# EAGLE design BUS_SPLIT_1 (EAGLE 6.5.0)
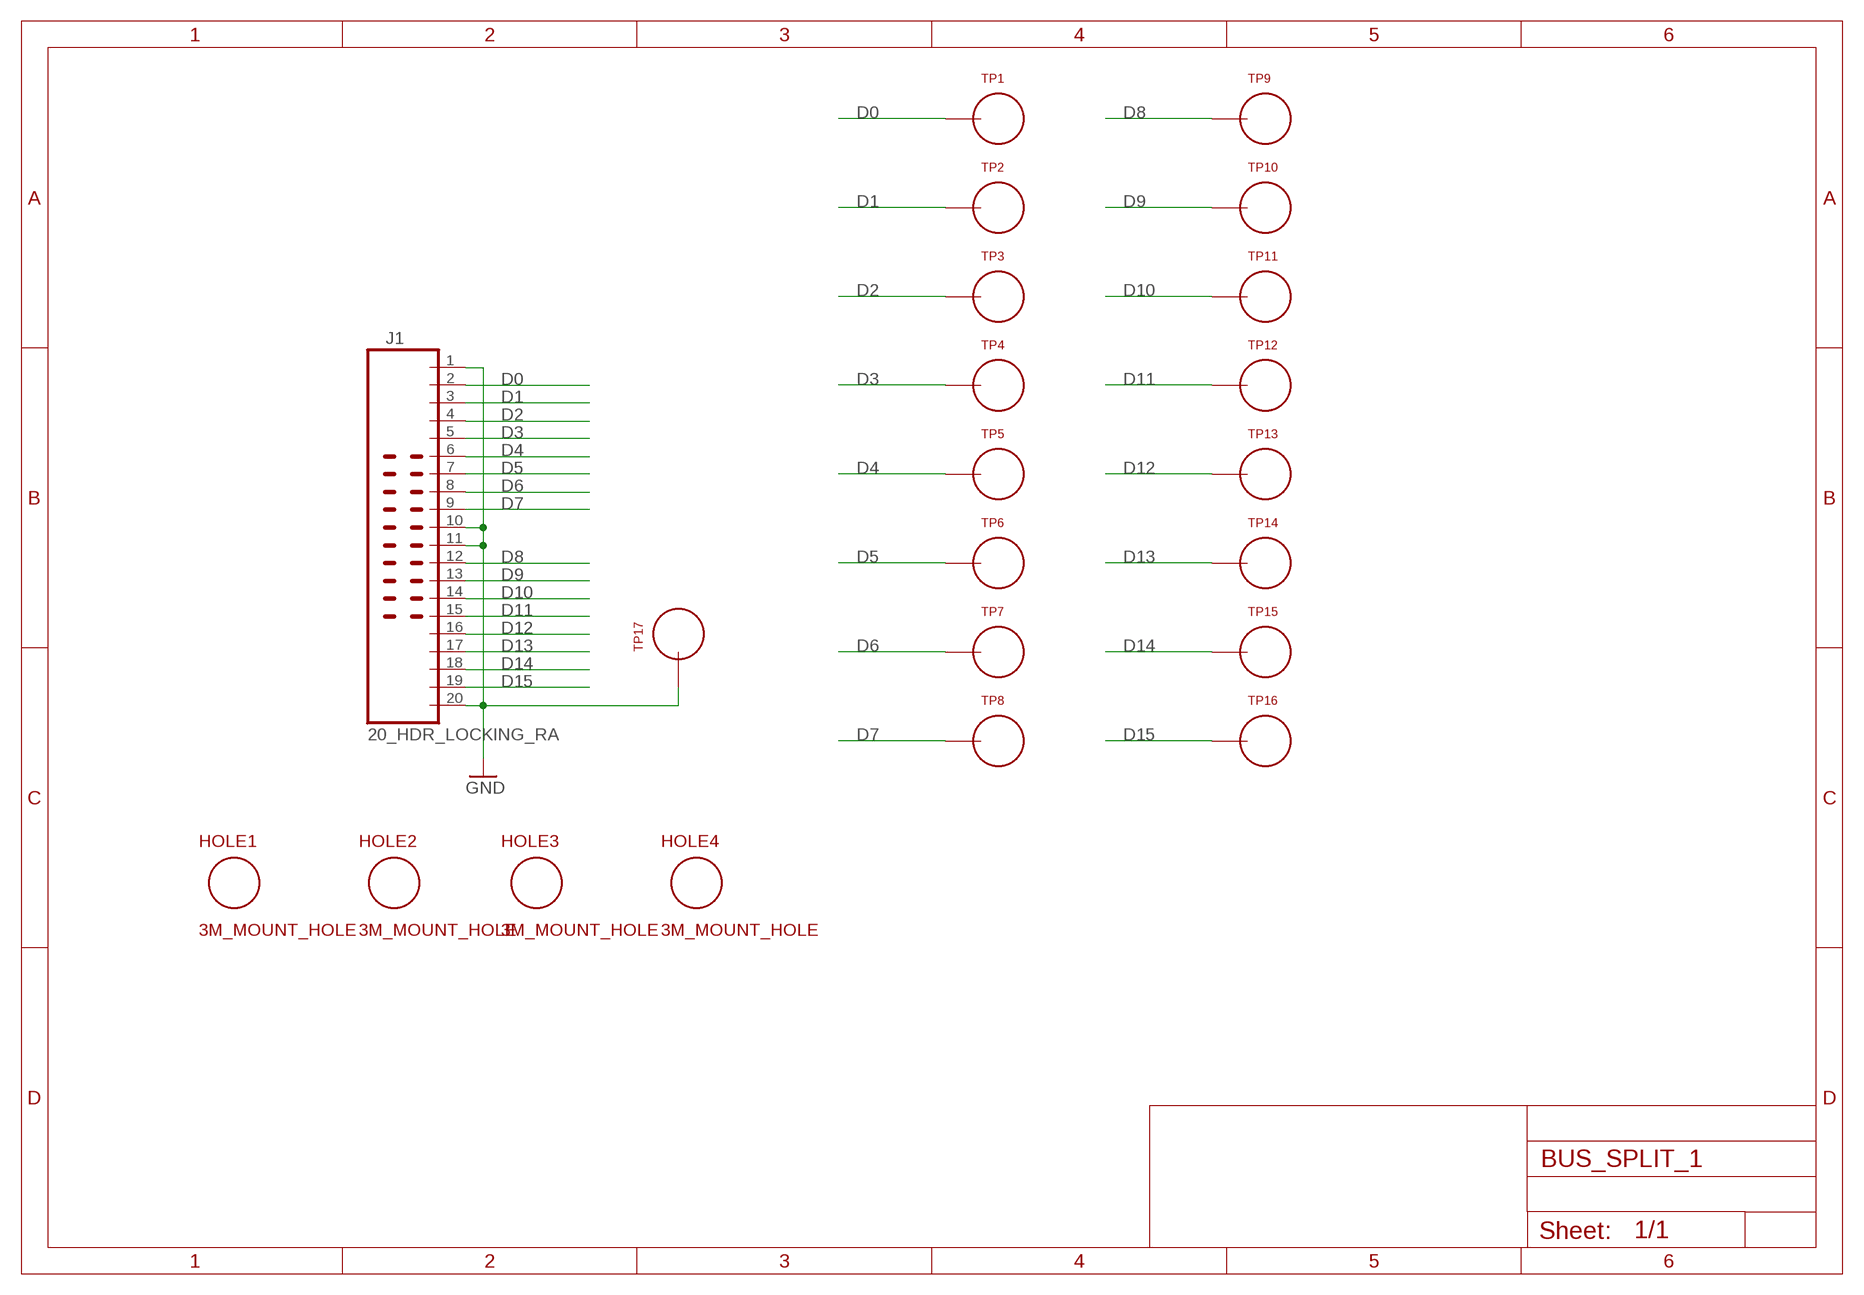
[diagram p0: schematic, sheet 1]

## Parts
HOLE1  3M_MOUNT_HOLE  [3M_HOLE]
HOLE2  3M_MOUNT_HOLE  [3M_HOLE]
HOLE3  3M_MOUNT_HOLE  [3M_HOLE]
HOLE4  3M_MOUNT_HOLE  [3M_HOLE]
J1  20_HDR_LOCKING_RA  [20_HDR_LOCKING_RA]
TP1  TEST_LOOP  [TEST_LOOP]
TP2  TEST_LOOP  [TEST_LOOP]
TP3  TEST_LOOP  [TEST_LOOP]
TP4  TEST_LOOP  [TEST_LOOP]
TP5  TEST_LOOP  [TEST_LOOP]
TP6  TEST_LOOP  [TEST_LOOP]
TP7  TEST_LOOP  [TEST_LOOP]
TP8  TEST_LOOP  [TEST_LOOP]
TP9  TEST_LOOP  [TEST_LOOP]
TP10  TEST_LOOP  [TEST_LOOP]
TP11  TEST_LOOP  [TEST_LOOP]
TP12  TEST_LOOP  [TEST_LOOP]
TP13  TEST_LOOP  [TEST_LOOP]
TP14  TEST_LOOP  [TEST_LOOP]
TP15  TEST_LOOP  [TEST_LOOP]
TP16  TEST_LOOP  [TEST_LOOP]
TP17  TEST_LOOP  [TEST_LOOP]

## Nets
D0: J1.2 TP1.P$1
D1: J1.3 TP2.P$1
D2: J1.4 TP3.P$1
D3: J1.5 TP4.P$1
D4: J1.6 TP5.P$1
D5: J1.7 TP6.P$1
D6: J1.8 TP7.P$1
D7: J1.9 TP8.P$1
D8: J1.12 TP9.P$1
D9: J1.13 TP10.P$1
D10: J1.14 TP11.P$1
D11: J1.15 TP12.P$1
D12: J1.16 TP13.P$1
D13: J1.17 TP14.P$1
D14: J1.18 TP15.P$1
D15: J1.19 TP16.P$1
GND: J1.1 J1.10 J1.11 J1.20 TP17.P$1

## Library data of the parts
HOLE1-HOLE4 = MyLib:3M_MOUNT_HOLE
J1 = MyLib:20_HDR_LOCKING_RA
TP1-TP17 = MyLib:TEST_LOOP

## Board
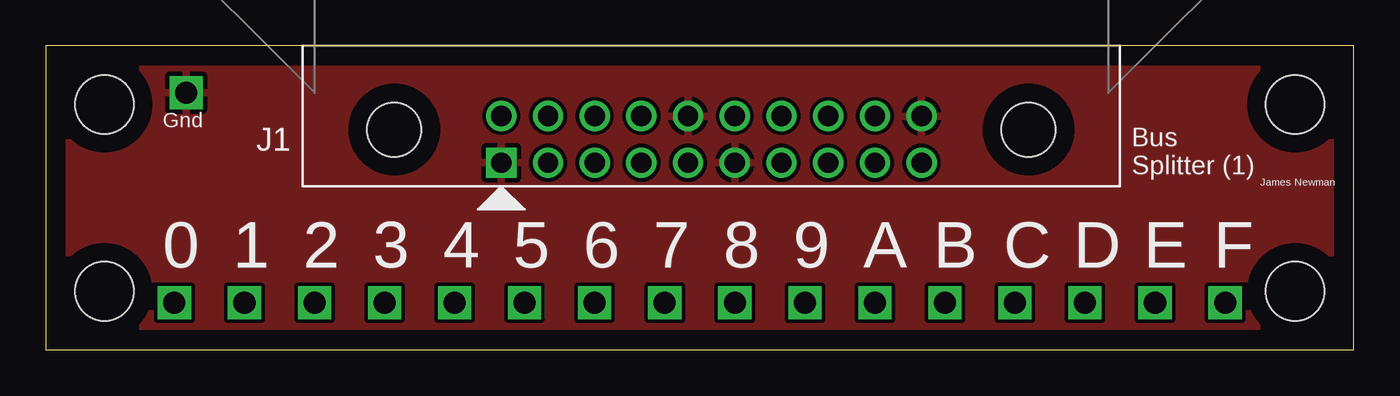
[diagram p1: board, top side]
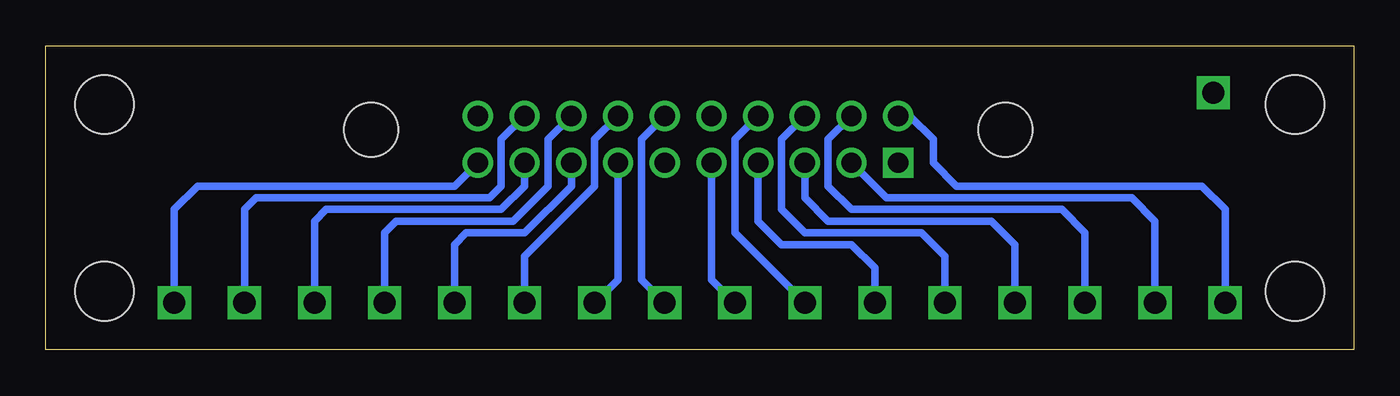
[diagram p2: board, bottom side, seen from below]

Size 71.12 x 16.51 mm. Coordinates in mm from the lower left corner, seen from the top.
Outline: 0,0 71.12,0 71.12,16.51 0,16.51 0,0
Copper layers (1*16): Top 0.035mm / dielectric 1.5mm / Bottom 0.035mm
Design rules "default": minimum track width 10mil, minimum drill 24mil, track to track 8mil, track to pad 8mil, pad to pad 8mil, via to via 8mil, smd to smd 8mil, copper to edge 40mil, drill to drill 8mil, minimum pad ring 10mil, minimum via ring 8mil, stop-mask expansion 4mil, vias tented up to drill 0mil, thermal gap 10mil

### Footprints (pad centres in the part's own frame; a part is rotated, then mirrored left to right if it is on the bottom)
3M_HOLE = hole 3.2: 0,0
20_HDR_LOCKING_RA = drill 1.1 square: 1 -11.43,-1.27 | drill 1.1: 2 -11.43,1.27; 3 -8.89,-1.27; 4 -8.89,1.27; 5 -6.35,-1.27; 6 -6.35,1.27; 7 -3.81,-1.27; 8 -3.81,1.27; 9 -1.27,-1.27; 10 -1.27,1.27; 11 1.27,-1.27; 12 1.27,1.27; 13 3.81,-1.27; 14 3.81,1.27; 15 6.35,-1.27; 16 6.35,1.27; 17 8.89,-1.27; 18 8.89,1.27; 19 11.43,-1.27; 20 11.43,1.27 | hole 2.946: -17.247,0.533; 17.247,0.533
TEST_LOOP = drill 1.2 square: P$1 0,0

### Placement (x,y rotation side)
HOLE1  3.17,3.17 0 top
HOLE2  3.17,13.34 0 top
HOLE3  67.94,13.34 0 top
HOLE4  67.94,3.17 0 top
J1  36.2,11.43 0 top
TP1  6.99,2.54 0 top
TP2  10.79,2.54 0 top
TP3  14.61,2.54 0 top
TP4  18.41,2.54 0 top
TP5  22.23,2.54 0 top
TP6  26.04,2.54 0 top
TP7  29.84,2.54 0 top
TP8  33.66,2.54 0 top
TP9  37.47,2.54 0 top
TP10  41.27,2.54 0 top
TP11  45.09,2.54 0 top
TP12  48.9,2.54 0 top
TP13  52.7,2.54 0 top
TP14  56.52,2.54 0 top
TP15  60.33,2.54 0 top
TP16  64.14,2.54 0 top
TP17  7.62,13.97 0 top

### Tracks (layer width: path | path; a pad name or v marks a point on that pad's centre or on a via)
D0
  Bottom 0.406: J1.2 24.13,12.7 22.86,11.43 22.86,10.16 21.59,8.89 8.26,8.89 6.99,7.62 TP1.P$1
D1
  Bottom 0.406: J1.3 25.4,8.26 12.06,8.26 10.79,6.99 TP2.P$1
D2
  Bottom 0.406: J1.4 28.57,11.43 28.57,8.89 27.3,7.62 15.88,7.62 14.61,6.35 TP3.P$1
D3
  Bottom 0.406: J1.5 29.84,8.26 28.57,6.99 19.68,6.99 18.41,5.71 TP4.P$1
D4
  Bottom 0.406: J1.6 31.11,11.43 31.11,7.62 29.84,6.35 23.5,6.35 22.23,5.08 TP5.P$1
D5
  Bottom 0.406: J1.7 32.38,6.99 31.11,5.71 27.3,5.71 26.04,4.45 TP6.P$1
D6
  Bottom 0.406: J1.8 33.66,11.43 33.66,6.35 TP7.P$1
D7
  Bottom 0.406: J1.9 34.92,3.81 TP8.P$1
D8
  Bottom 0.406: J1.12 38.73,11.43 38.73,3.81 TP9.P$1
D9
  Bottom 0.406: J1.13 40.01,3.81 TP10.P$1
D10
  Bottom 0.406: J1.14 41.27,11.43 41.27,8.89 45.09,5.08 TP11.P$1
D11
  Bottom 0.406: J1.15 42.55,8.89 45.09,6.35 48.26,6.35 48.9,5.71 TP12.P$1
D12
  Bottom 0.406: J1.16 43.81,11.43 43.81,8.89 45.72,6.99 52.07,6.99 52.7,6.35 TP13.P$1
D13
  Bottom 0.406: J1.17 45.09,8.89 46.35,7.62 55.88,7.62 56.52,6.99 TP14.P$1
D14
  Bottom 0.406: J1.18 46.35,11.43 46.35,8.89 46.99,8.26 59.69,8.26 60.33,7.62 TP15.P$1
D15
  Bottom 0.406: J1.19 48.9,8.89 62.87,8.89 64.14,7.62 TP16.P$1
GND
  pour Top: 1.27,15.24 69.85,15.24 69.85,1.27 1.27,1.27

### Text on the board
tPlace: Gnd | Bus / Splitter (1) | James Newman | 0 | 1 | 2 | 3 | 4 | 5 | 6 | 7 | 8 | 9 | A | B | C | D | E | F